# EAGLE schematic EMF_Trinket (EAGLE 7.7.0)
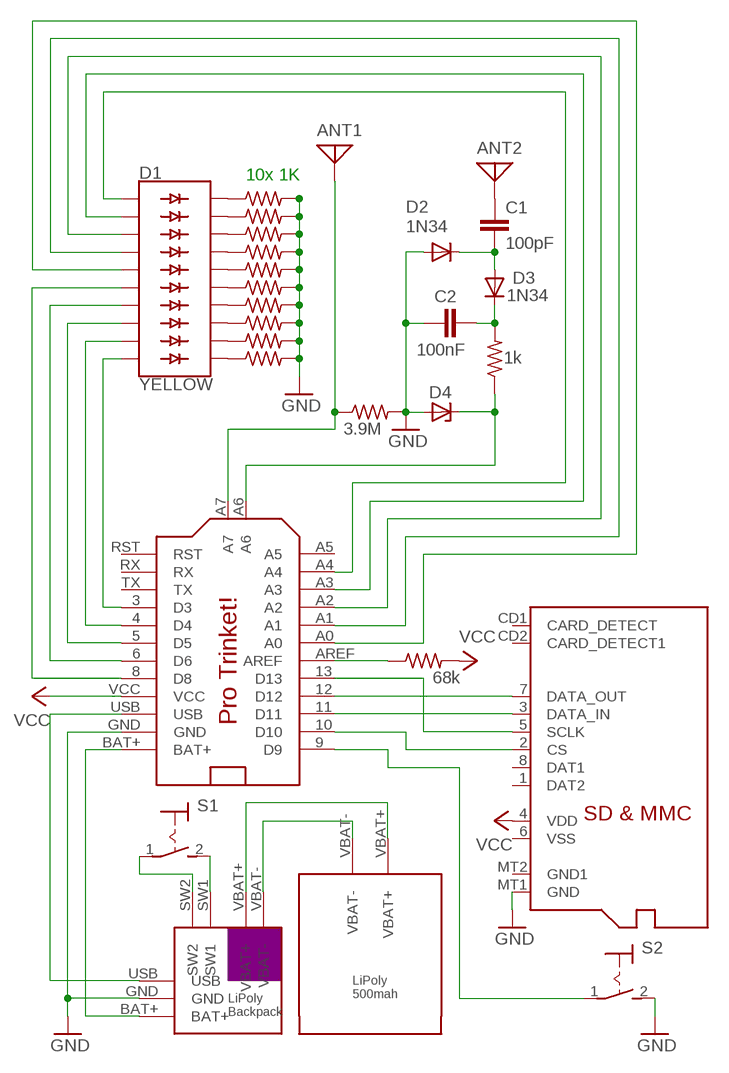
[diagram p0: schematic, sheet 1]

## Parts
ANT1  ANTENNA  [PAD-01]
ANT2  ANTENNA  [PAD-01]
C1  100pF  C5/2.5  [C5B2.5]
C2  100nF  C5/2.5  [C5B2.5]
D1  YELLOW  LED_BARGRAPH_10YELLOW  [LED_BARGRAPH_10]
D2  1N34  AA112  [DO07]
D3  1N34  AA112  [DO07]
D4  ZENER-DIODEDO35Z10  [DO35Z10]
R1  R-US_0204/2V  [0204V]
R2  R-US_0204/2V  [0204V]
R3  R-US_0204/2V  [0204V]
R4  R-US_0204/2V  [0204V]
R5  R-US_0204/2V  [0204V]
R6  R-US_0204/2V  [0204V]
R7  R-US_0204/2V  [0204V]
R8  R-US_0204/2V  [0204V]
R9  R-US_0204/2V  [0204V]
R10  R-US_0204/2V  [0204V]
R11  1k  R-US_0204/2V  [0204V]
R12  3.9M  R-US_0204/2V  [0204V]
R13  68k  R-US_0204/2V  [0204V]
S1  MS243  [MS243]
S2  MS243  [MS243]
U$1  PRO_TRINKET  [PROTRINKET]
U$2  LIPOLY_BACKPACK  [LIPOLY_BACKPACK]
U$3  MICROSD  [MICROSD]
U$4  LIPOLY_BATTERY  [LIPOLY_BATTERY]

## Nets
GND: C2.1 D2.A D4.A R1.2 R2.2 R3.2 R4.2 R5.2 R6.2 R7.2 R8.2 R9.2 R10.2 R12.2 S2.2(S) U$1.GND U$2.GND U$3.MT1(GND)
N$1: D1.10(A9) U$1.3(D3)
N$2: D1.9(A8) U$1.4(D4)
N$3: D1.8(A7) U$1.5(D5)
N$4: D1.7(A6) U$1.6(D6)
N$5: D1.6(A5) U$1.8(D8)
N$6: D1.5(A4) U$1.A0
N$7: D1.4(A3) U$1.A1
N$8: D1.3(A2) U$1.A2
N$9: D1.2(A1) U$1.A3
N$10: D1.1(A) U$1.A4
N$11: D1.20(C) R1.1
N$12: D1.19(C1) R2.1
N$13: D1.18(C2) R3.1
N$14: D1.17(C3) R4.1
N$15: D1.16(C4) R5.1
N$16: D1.15(C5) R6.1
N$17: D1.14(C6) R7.1
N$18: D1.13(C7) R8.1
N$19: D1.12(C8) R9.1
N$20: D1.11(C9) R10.1
N$21: R13.1 U$1.AREF
N$22: ANT1.1 R12.1 U$1.A7
N$23: ANT2.1 C1.1
N$24: C1.2 D2.C D3.A
N$25: C2.2 D3.C R11.2
N$26: U$1.BAT+ U$2.BAT+
N$27: S1.2(S) U$2.SW1
N$28: D4.C R11.1 U$1.A6
N$29: S1.1(P) U$2.SW2
N$30: U$1.USB U$2.USB
N$31: U$1.10(D10) U$3.2(CS)
N$32: U$1.11(D11) U$3.3(DATA_IN)
N$33: S2.1(P) U$1.9(D9)
N$34: U$1.12(D12) U$3.7(DATA_OUT)
N$35: U$1.13(D13) U$3.5(SCLK)
N$36: U$2.VBAT- U$4.VBAT-
N$37: U$2.VBAT+ U$4.VBAT+
VCC: R13.2 U$1.VCC U$3.4(VDD)
Unconnected: U$1.A5 U$1.RST U$1.RX U$1.TX U$3.1(DAT2) U$3.6(VSS) U$3.8(DAT1) U$3.CD1(CARD_DETECT) U$3.CD2(CARD_DETECT1) U$3.MT2(GND1)

## Notes on the sheet
- 10x 1K

## Library data of the parts
ANT1 ANT2 = discrete:ANTENNA: Antenna
C1 C2 = capacitor-wima:C: CAPACITOR naming: grid - package width
D1 = SparkFun-LED:LED_BARGRAPH_10: Young Sun LED Tech - YSLB-10251G5-10 10-Segment LED Bar Graph Features: Red Vf = 2.1V, Ifmax = 20mA Yellow Vf = 2.1V, Ifmax = 20mA Blue Vf = 3.4V, Ifmax = 20mA Green Vf = 3.4V, Ifmax = 20mA SparkFun Products: Red <https://www.sparkfun.com/products/9935> Yellow <https://www.sparkfun.com/products/9936> Green <https://www.sparkfun.com/products/9938> Blue <https://www.sparkfun.com/products/9937>; PROD_ID: DIO-10614
D2 D3 = diode:AA112: DIODE germanium
D4 = diode:ZENER-DIODE: Z-Diode
R1-R13 = adafruit:R-US_: RESISTOR, American symbol
S1 S2 = switch:MS243: TOGGLE SWITCH
U$1 = adafruit:PRO_TRINKET
U$2 = lipoly_backpack:LIPOLY_BACKPACK
U$3 = adafruit:MICROSD: Micro-SD / Transflash card holder with SPI pinout For the 3M # 2908-05WB-MG and/or 4UCON #19656 push-push type
U$4 = lipoly_backpack:LIPOLY_BATTERY